# Altium schematic sheet Architecture.SchDoc
size 420 x 297 mm; CheckedBy: Bao Bui Q.; Engineer: Hung Nguyen D.; Revision: 1.0.0; SheetNumber: 1; SheetTotal: 6
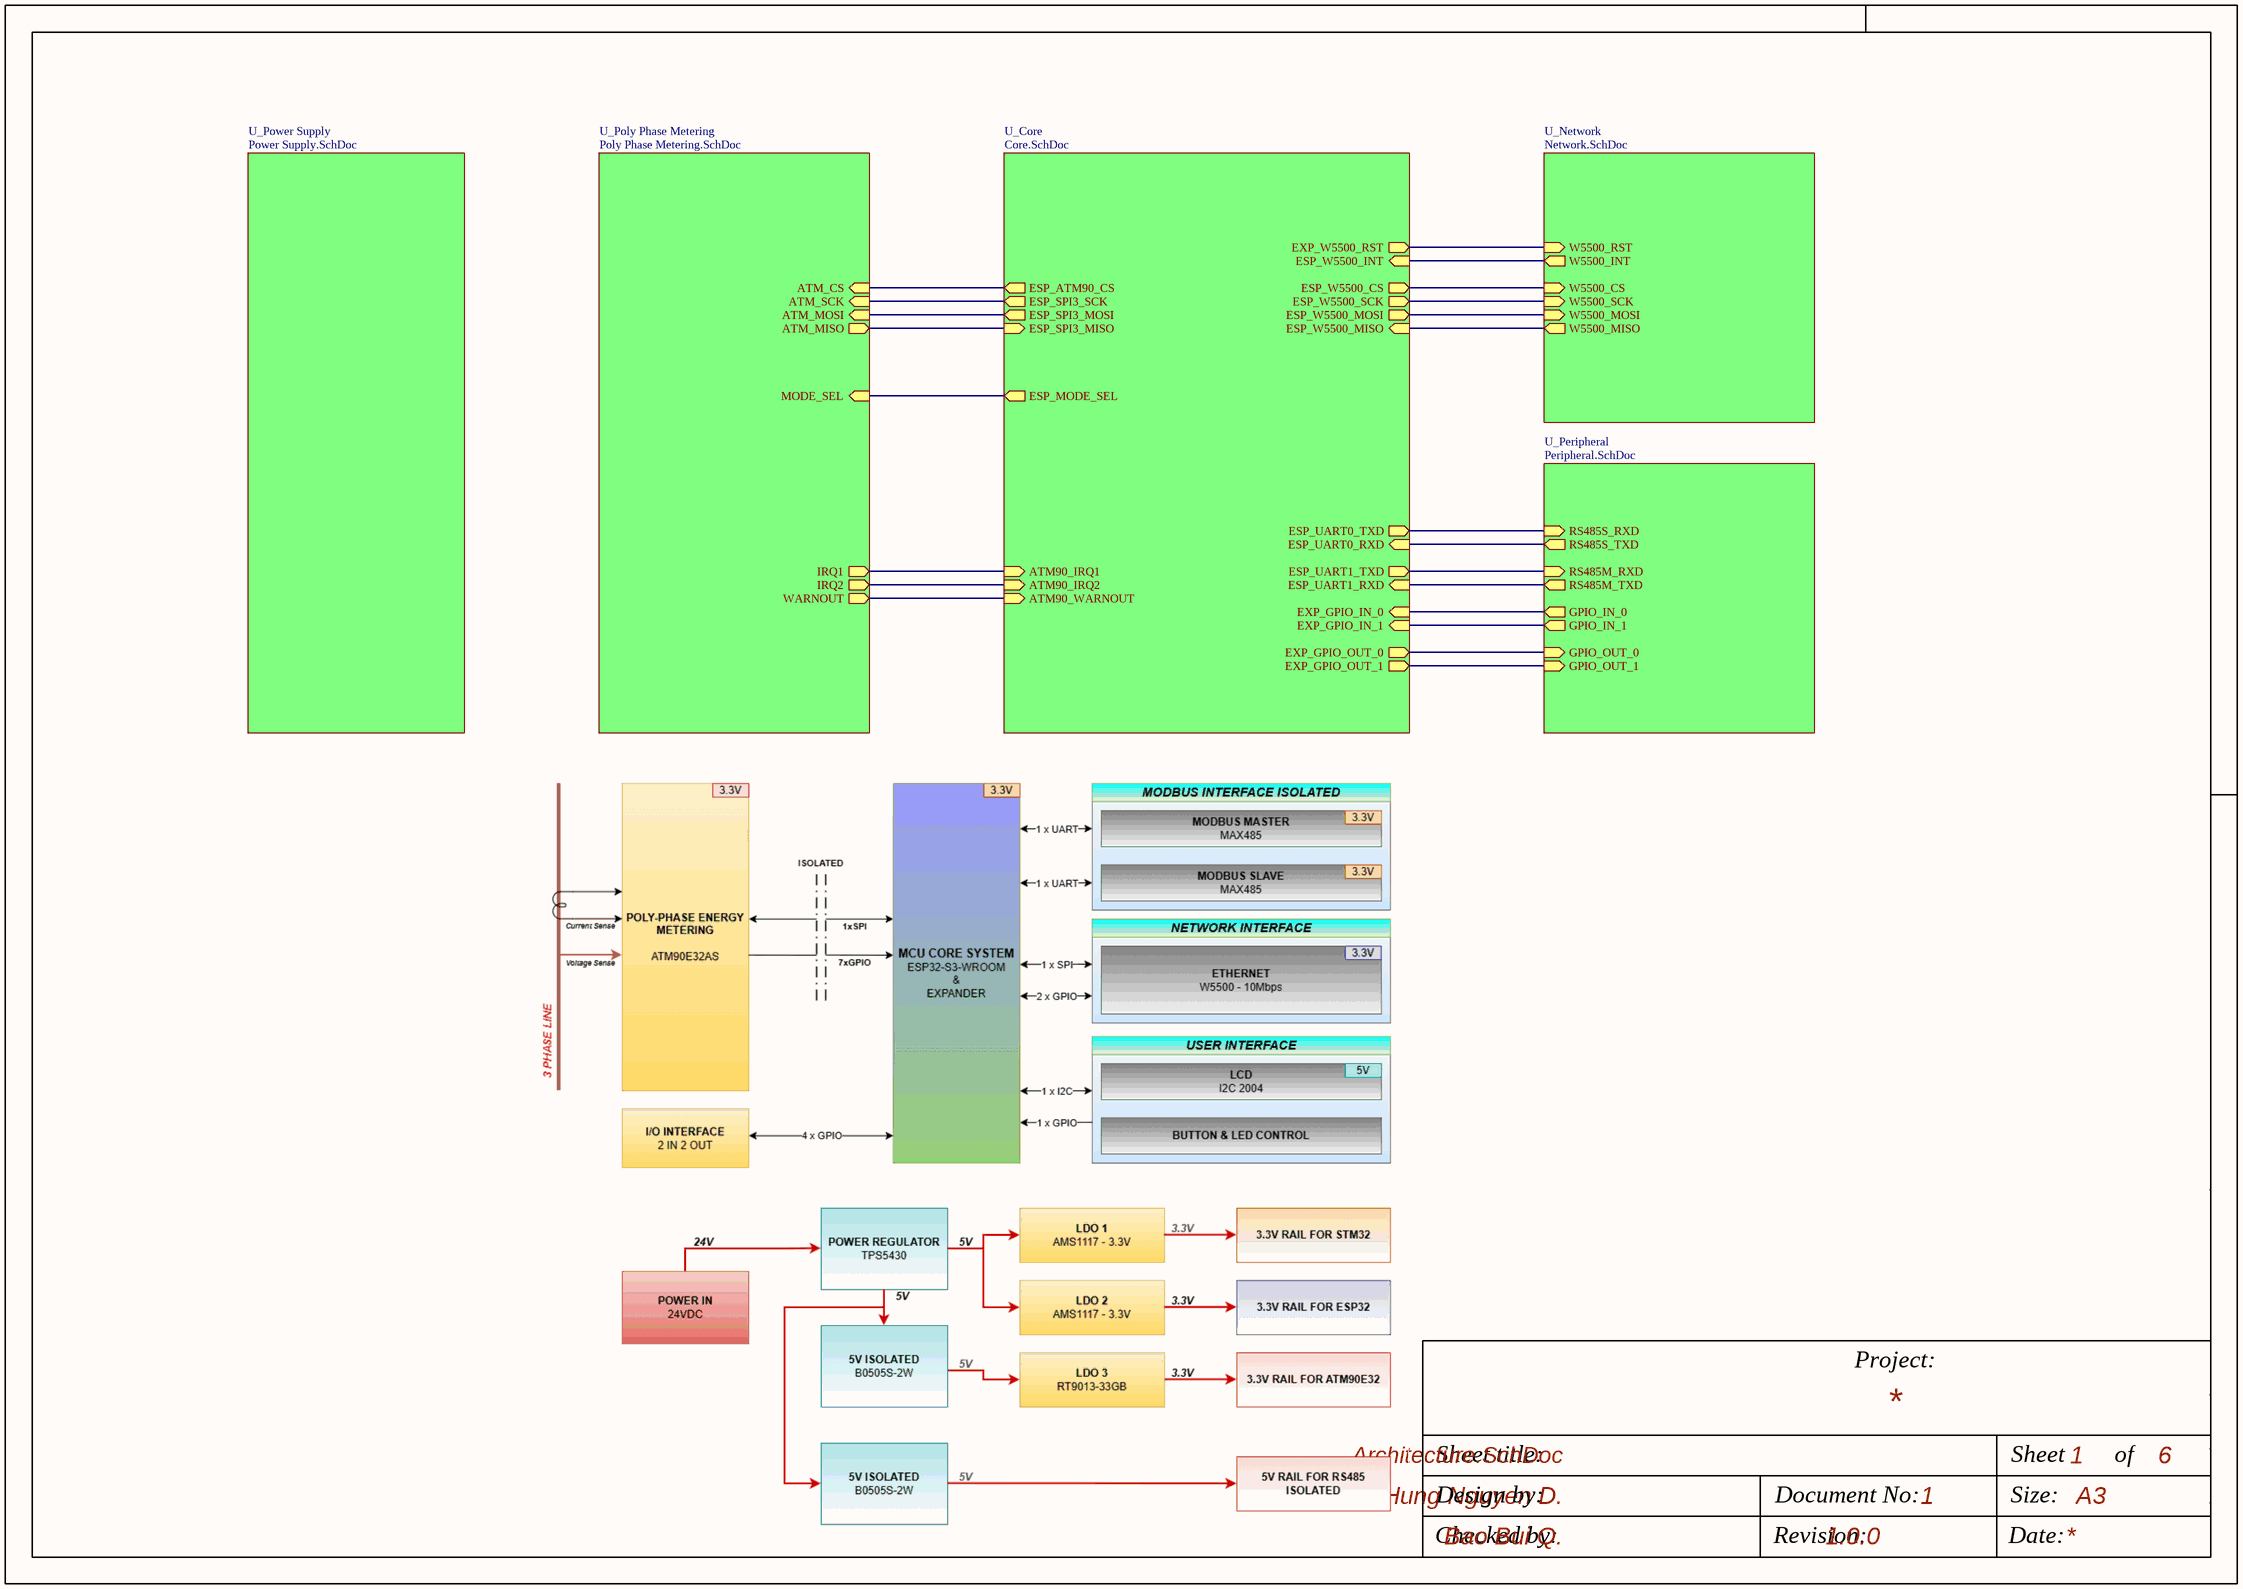
[diagram p0: Architecture.SchDoc]

## Sub-sheets
U_Core = Core.SchDoc: ESP_SPI3_SCK (out), ESP_SPI3_MOSI (out), ESP_W5500_CS (out), ESP_SPI3_MISO (in), ESP_UART0_TXD (out), ESP_ATM90_CS (out), ESP_UART0_RXD (in), ESP_UART1_TXD (out), ESP_UART1_RXD (in), EXP_W5500_RST (out), ESP_W5500_INT (in), EXP_GPIO_IN_0 (in), EXP_GPIO_IN_1 (in), EXP_GPIO_OUT_0 (out), EXP_GPIO_OUT_1 (out), ATM90_IRQ1 (in), ATM90_IRQ2 (in), ATM90_WARNOUT (in), ESP_W5500_MISO (in), ESP_W5500_MOSI (out), ESP_W5500_SCK (out), ESP_MODE_SEL (out)
U_Network = Network.SchDoc: W5500_RST (in), W5500_INT (out), W5500_SCK (in), W5500_MOSI (in), W5500_MISO (out), W5500_CS (in)
U_Peripheral = Peripheral.SchDoc: RS485M_RXD (in), RS485M_TXD (out), RS485S_RXD (in), RS485S_TXD (out), GPIO_IN_0 (out), GPIO_OUT_0 (in), GPIO_IN_1 (out), GPIO_OUT_1 (in)
U_Poly Phase Metering = Poly Phase Metering.SchDoc: IRQ1 (out), IRQ2 (out), WARNOUT (out), ATM_CS (in), ATM_SCK (in), ATM_MOSI (in), ATM_MISO (out), MODE_SEL (in)
U_Power Supply = Power Supply.SchDoc: no entries

## Nets
(unnamed): sheet U_Network/W5500_RST, sheet U_Core/EXP_W5500_RST
(unnamed): sheet U_Network/W5500_INT, sheet U_Core/ESP_W5500_INT
(unnamed): sheet U_Network/W5500_SCK, sheet U_Core/ESP_W5500_SCK
(unnamed): sheet U_Network/W5500_MOSI, sheet U_Core/ESP_W5500_MOSI
(unnamed): sheet U_Network/W5500_MISO, sheet U_Core/ESP_W5500_MISO
(unnamed): sheet U_Network/W5500_CS, sheet U_Core/ESP_W5500_CS
(unnamed): sheet U_Peripheral/RS485M_RXD, sheet U_Core/ESP_UART1_TXD
(unnamed): sheet U_Peripheral/RS485M_TXD, sheet U_Core/ESP_UART1_RXD
(unnamed): sheet U_Peripheral/RS485S_RXD, sheet U_Core/ESP_UART0_TXD
(unnamed): sheet U_Peripheral/RS485S_TXD, sheet U_Core/ESP_UART0_RXD
(unnamed): sheet U_Peripheral/GPIO_IN_0, sheet U_Core/EXP_GPIO_IN_0
(unnamed): sheet U_Peripheral/GPIO_OUT_0, sheet U_Core/EXP_GPIO_OUT_0
(unnamed): sheet U_Peripheral/GPIO_IN_1, sheet U_Core/EXP_GPIO_IN_1
(unnamed): sheet U_Peripheral/GPIO_OUT_1, sheet U_Core/EXP_GPIO_OUT_1
(unnamed): sheet U_Poly Phase Metering/IRQ1, sheet U_Core/ATM90_IRQ1
(unnamed): sheet U_Poly Phase Metering/IRQ2, sheet U_Core/ATM90_IRQ2
(unnamed): sheet U_Poly Phase Metering/WARNOUT, sheet U_Core/ATM90_WARNOUT
(unnamed): sheet U_Poly Phase Metering/ATM_CS, sheet U_Core/ESP_ATM90_CS
(unnamed): sheet U_Poly Phase Metering/ATM_SCK, sheet U_Core/ESP_SPI3_SCK
(unnamed): sheet U_Poly Phase Metering/ATM_MOSI, sheet U_Core/ESP_SPI3_MOSI
(unnamed): sheet U_Poly Phase Metering/ATM_MISO, sheet U_Core/ESP_SPI3_MISO
(unnamed): sheet U_Poly Phase Metering/MODE_SEL, sheet U_Core/ESP_MODE_SEL

## Notes on the sheet
- Project:
- Sheet title:
- Sheet
- of
- Design by:
- Document No:
- Size:
- A3
- Checked by:
- Revision:
- Date: